# Altium project HOT_PLATE.PrjPcb
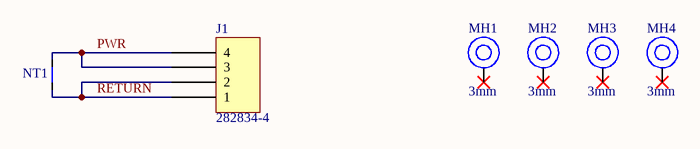
[diagram p0: plate.SchDoc]
1 sheet, 6 parts. Net scope: global (net labels, ports and power ports of the same name join across sheets).
Board files: Plate_A.PcbDoc, Plate_B.PcbDoc, Plate_C.PcbDoc, Plate_D.PcbDoc, Plate_E.PcbDoc

## Sheet plate.SchDoc
size A4; SheetNumber: 1; SheetTotal: 1

### Parts
J1  282834-4  [TE 282834-4]
MH1  3mm  [Mount-Hole_3mm]
MH2  3mm  [Mount-Hole_3mm]
MH3  3mm  [Mount-Hole_3mm]
MH4  3mm  [Mount-Hole_3mm]
NT1  Net Tie  [NetTie_50mil]  (value not drawn)  (net tie, no BOM)

### Nets
PWR: J1.3 J1.4 NT1.2
RETURN: J1.1 J1.2 NT1.1

Not connected (* = marked no-connect by the designer): MH1 1*; MH2 1*; MH3 1*; MH4 1*

### Library data of the parts
J1 = 282834-4: TERM BLK 4P SIDE ENT 2.54MM PCB; Manufacturer: TE Connectivity AMP Connectors; Current: 10A; Mating Orientation: Horizontal with Board; Number of Levels: 1; Pitch: 0.100" (2.54mm); Positions Per Level: 4; Voltage: 150V; Wire Gauge: 16-30 AWG; Wire Termination: Screw - Rising Cage Clamp; Part Number: 282834-4; Color: Green; ComponentLink1Description: Datasheet; ComponentLink1URL: https://www.te.com/commerce/DocumentDelivery/DDEController?Action=srchrtrv&DocNm=282834&DocType=Customer+Drawing&DocLang=English; ComponentLink2Description: DigiKey Link; ComponentLink2URL: http://digikey.com/product-detail/en/te-connectivity-amp-connectors/282834-4/A98335-ND/1153265; LastUpdated: 2020-01-15 4:16:05 AM; Lifecycle Status: Active; Minimum Order: 1; Mounting Type: Through Hole; Packaging: Bulk; Part Status: Active; Price: 2.68; Series: Buchanan; Supplier 1: DigiKey; Supplier Part Number 1: A98335-ND
MH1-MH4 = Mount_Hole_3mm: Mounting Hole 3mm plated
NT1 = NetTie_50mil: Net Tie with 50mil trace